# Altium schematic sheet 08 BALUN.SchDoc
size A3
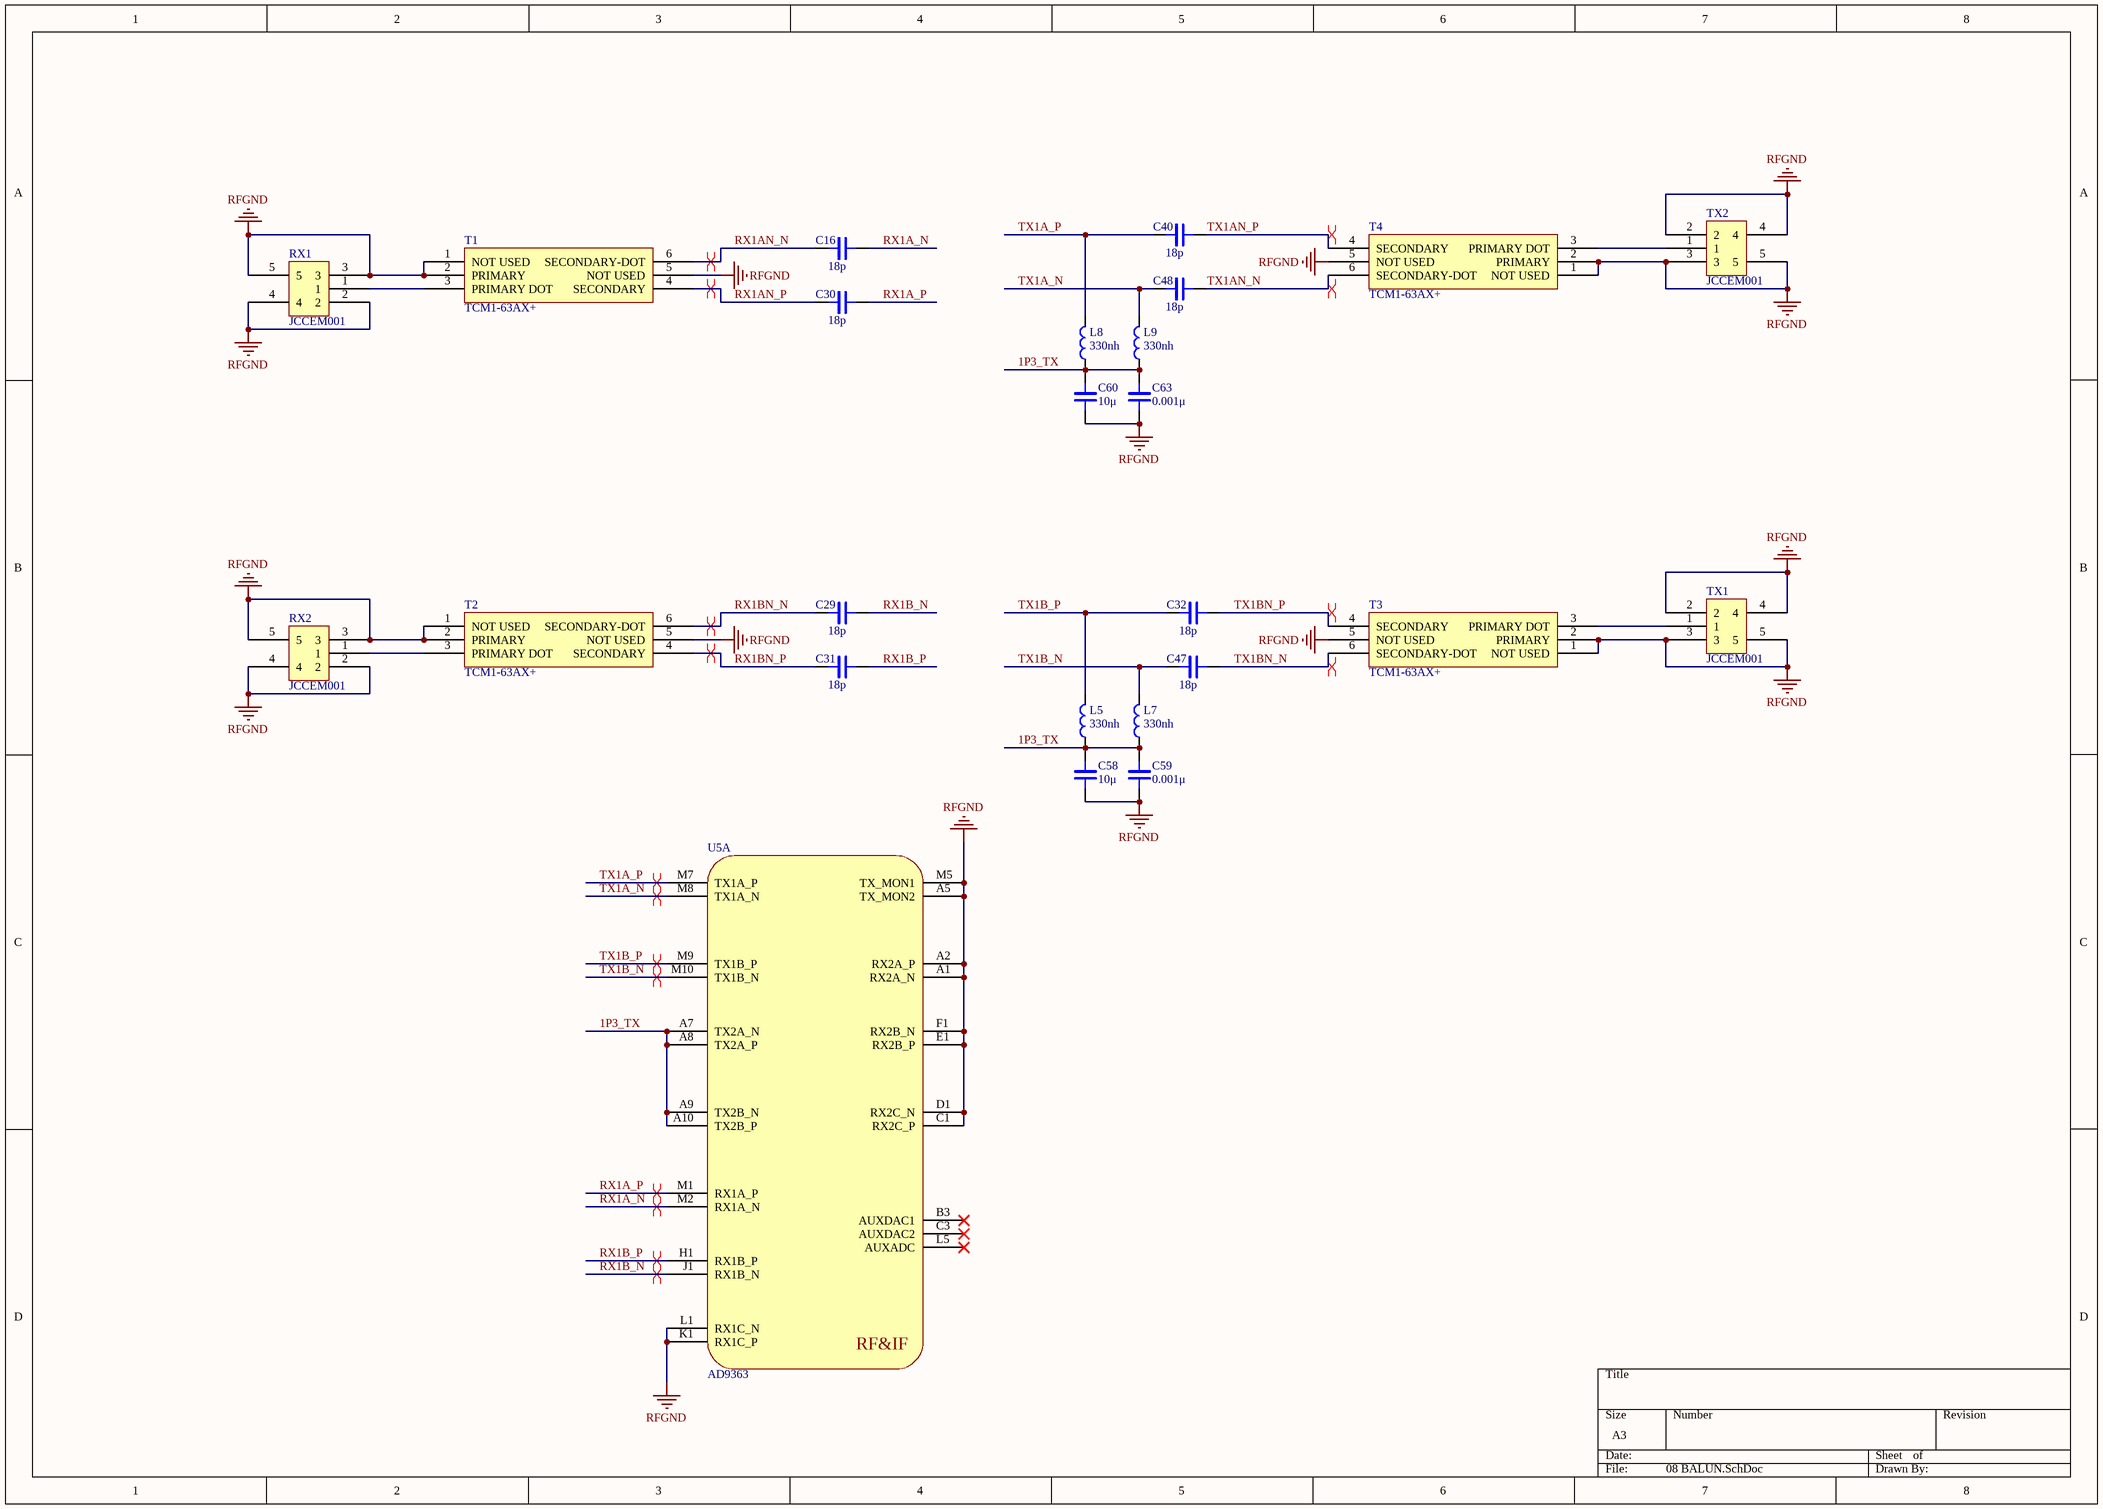
[diagram p0: 08 BALUN.SchDoc]

## Parts
C16  18p  [LC-0402_C]
C29  18p  [LC-0402_C]
C30  18p  [LC-0402_C]
C31  18p  [LC-0402_C]
C32  18p  [LC-0402_C]
C40  18p  [LC-0402_C]
C47  18p  [LC-0402_C]
C48  18p  [LC-0402_C]
C58  10μ  [LC-0402_C]
C59  0.001μ  [LC-0402_C]
C60  10μ  [LC-0402_C]
C63  0.001μ  [LC-0402_C]
L5  330nh  [LC-0603_L]
L7  330nh  [LC-0603_L]
L8  330nh  [LC-0603_L]
L9  330nh  [LC-0603_L]
RX1  JCCEM001  [CNSMARAL687W375H171]
RX2  JCCEM001  [CNSMARAL687W375H171]
T1  TCM1-63AX+  [TSML150W160H160]
T2  TCM1-63AX+  [TSML150W160H160]
T3  TCM1-63AX+  [TSML150W160H160]
T4  TCM1-63AX+  [TSML150W160H160]
TX1  JCCEM001  [CNSMARAL687W375H171]
TX2  JCCEM001  [CNSMARAL687W375H171]
U5  AD9363  [AD936X]  (part A of 3)

## Nets
RFGND: C58.2 C59.1 C60.2 C63.1 RX1.2 RX1.3 RX1.4 RX1.5 RX2.2 RX2.3 RX2.4 RX2.5 T1.1(NOT_USED) T1.2(PRIMARY) T1.5(NOT_USED) T2.1(NOT_USED) T2.2(PRIMARY) T2.5(NOT_USED) T3.1(NOT_USED) T3.2(PRIMARY) T3.5(NOT_USED) T4.1(NOT_USED) T4.2(PRIMARY) T4.5(NOT_USED) TX1.2 TX1.3 TX1.4 TX1.5 TX2.2 TX2.3 TX2.4 TX2.5 U5.A1(RX2A_N) U5.A2(RX2A_P) U5.A5(TX_MON2) U5.C1(RX2C_P) U5.D1(RX2C_N) U5.E1(RX2B_P) U5.F1(RX2B_N) U5.K1(RX1C_P) U5.L1(RX1C_N) U5.M5(TX_MON1)
1P3_TX: C58.1 C59.2 C60.1 C63.2 L5.1 L7.1 L8.1 L9.1 U5.A7(TX2A_N) U5.A8(TX2A_P) U5.A9(TX2B_N) U5.A10(TX2B_P)
RX1A_N: C16.2 U5.M2(RX1A_N)
RX1A_P: C30.2 U5.M1(RX1A_P)
RX1AN_N: C16.1 T1.6(SECONDARY-DOT)
RX1AN_P: C30.1 T1.4(SECONDARY)
RX1B_N: C29.2 U5.J1(RX1B_N)
RX1B_P: C31.2 U5.H1(RX1B_P)
RX1BN_N: C29.1 T2.6(SECONDARY-DOT)
RX1BN_P: C31.1 T2.4(SECONDARY)
TX1A_N: C48.1 L9.2 U5.M8(TX1A_N)
TX1A_P: C40.1 L8.2 U5.M7(TX1A_P)
TX1AN_N: C48.2 T4.6(SECONDARY-DOT)
TX1AN_P: C40.2 T4.4(SECONDARY)
TX1B_N: C47.1 L7.2 U5.M10(TX1B_N)
TX1B_P: C32.1 L5.2 U5.M9(TX1B_P)
TX1BN_N: C47.2 T3.6(SECONDARY-DOT)
TX1BN_P: C32.2 T3.4(SECONDARY)
NetRX1_1: RX1.1 T1.3(PRIMARY_DOT)
NetRX2_1: RX2.1 T2.3(PRIMARY_DOT)
NetT3_3: T3.3(PRIMARY_DOT) TX1.1
NetT4_3: T4.3(PRIMARY_DOT) TX2.1

Not connected (* = marked no-connect by the designer): U5 B3(AUXDAC1)* C3(AUXDAC2)* L5(AUXADC)*

## Layout directives
differential pair: RX1A_N, RX1A_P, RX1AN_N, RX1AN_P, RX1B_N, RX1B_P, RX1BN_N, RX1BN_P, TX1A_N, TX1A_P, TX1AN_N, TX1AN_P, TX1B_N, TX1B_P, TX1BN_N, TX1BN_P

## Notes on the sheet
- (in symbol AD9363, part A) RF&IF

## Library data of the parts
C16 C29-C32 C40 C47 C48 = CAP_1: Capacitor
C58-C60 C63 = CAP_2: Capacitor
L5 L7-L9 = INDUCTANCE